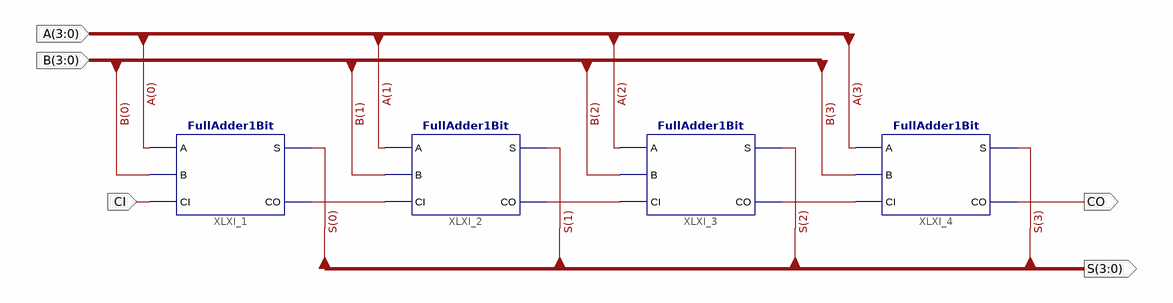
[diagram p0: schematic sheet 1]
// Xilinx ISE schematic Adder4.sch (spartan6) as structural Verilog: 4 symbols, 5 ports
module Adder4 (
  input  CI,
  input  [3:0] A,
  input  [3:0] B,
  output CO,
  output [3:0] S
);

  wire XLXN_1, XLXN_2, XLXN_3;

  FullAdder1Bit XLXI_1 (.A(A[0]), .B(B[0]), .CI(CI), .S(S[0]), .CO(XLXN_1));
  FullAdder1Bit XLXI_2 (.A(A[1]), .B(B[1]), .CI(XLXN_1), .S(S[1]), .CO(XLXN_2));
  FullAdder1Bit XLXI_3 (.A(A[2]), .B(B[2]), .CI(XLXN_2), .S(S[2]), .CO(XLXN_3));
  FullAdder1Bit XLXI_4 (.A(A[3]), .B(B[3]), .CI(XLXN_3), .S(S[3]), .CO(CO));
endmodule
